# EasyEDA schematic SCH_CAS-808_2025-10-24.json
TITLE: CADS-808; REV: 0.1; Date: 2025-10-24; Sheet: 1/1; Drawn By: stego144Hz; Company: Pandipon Industries
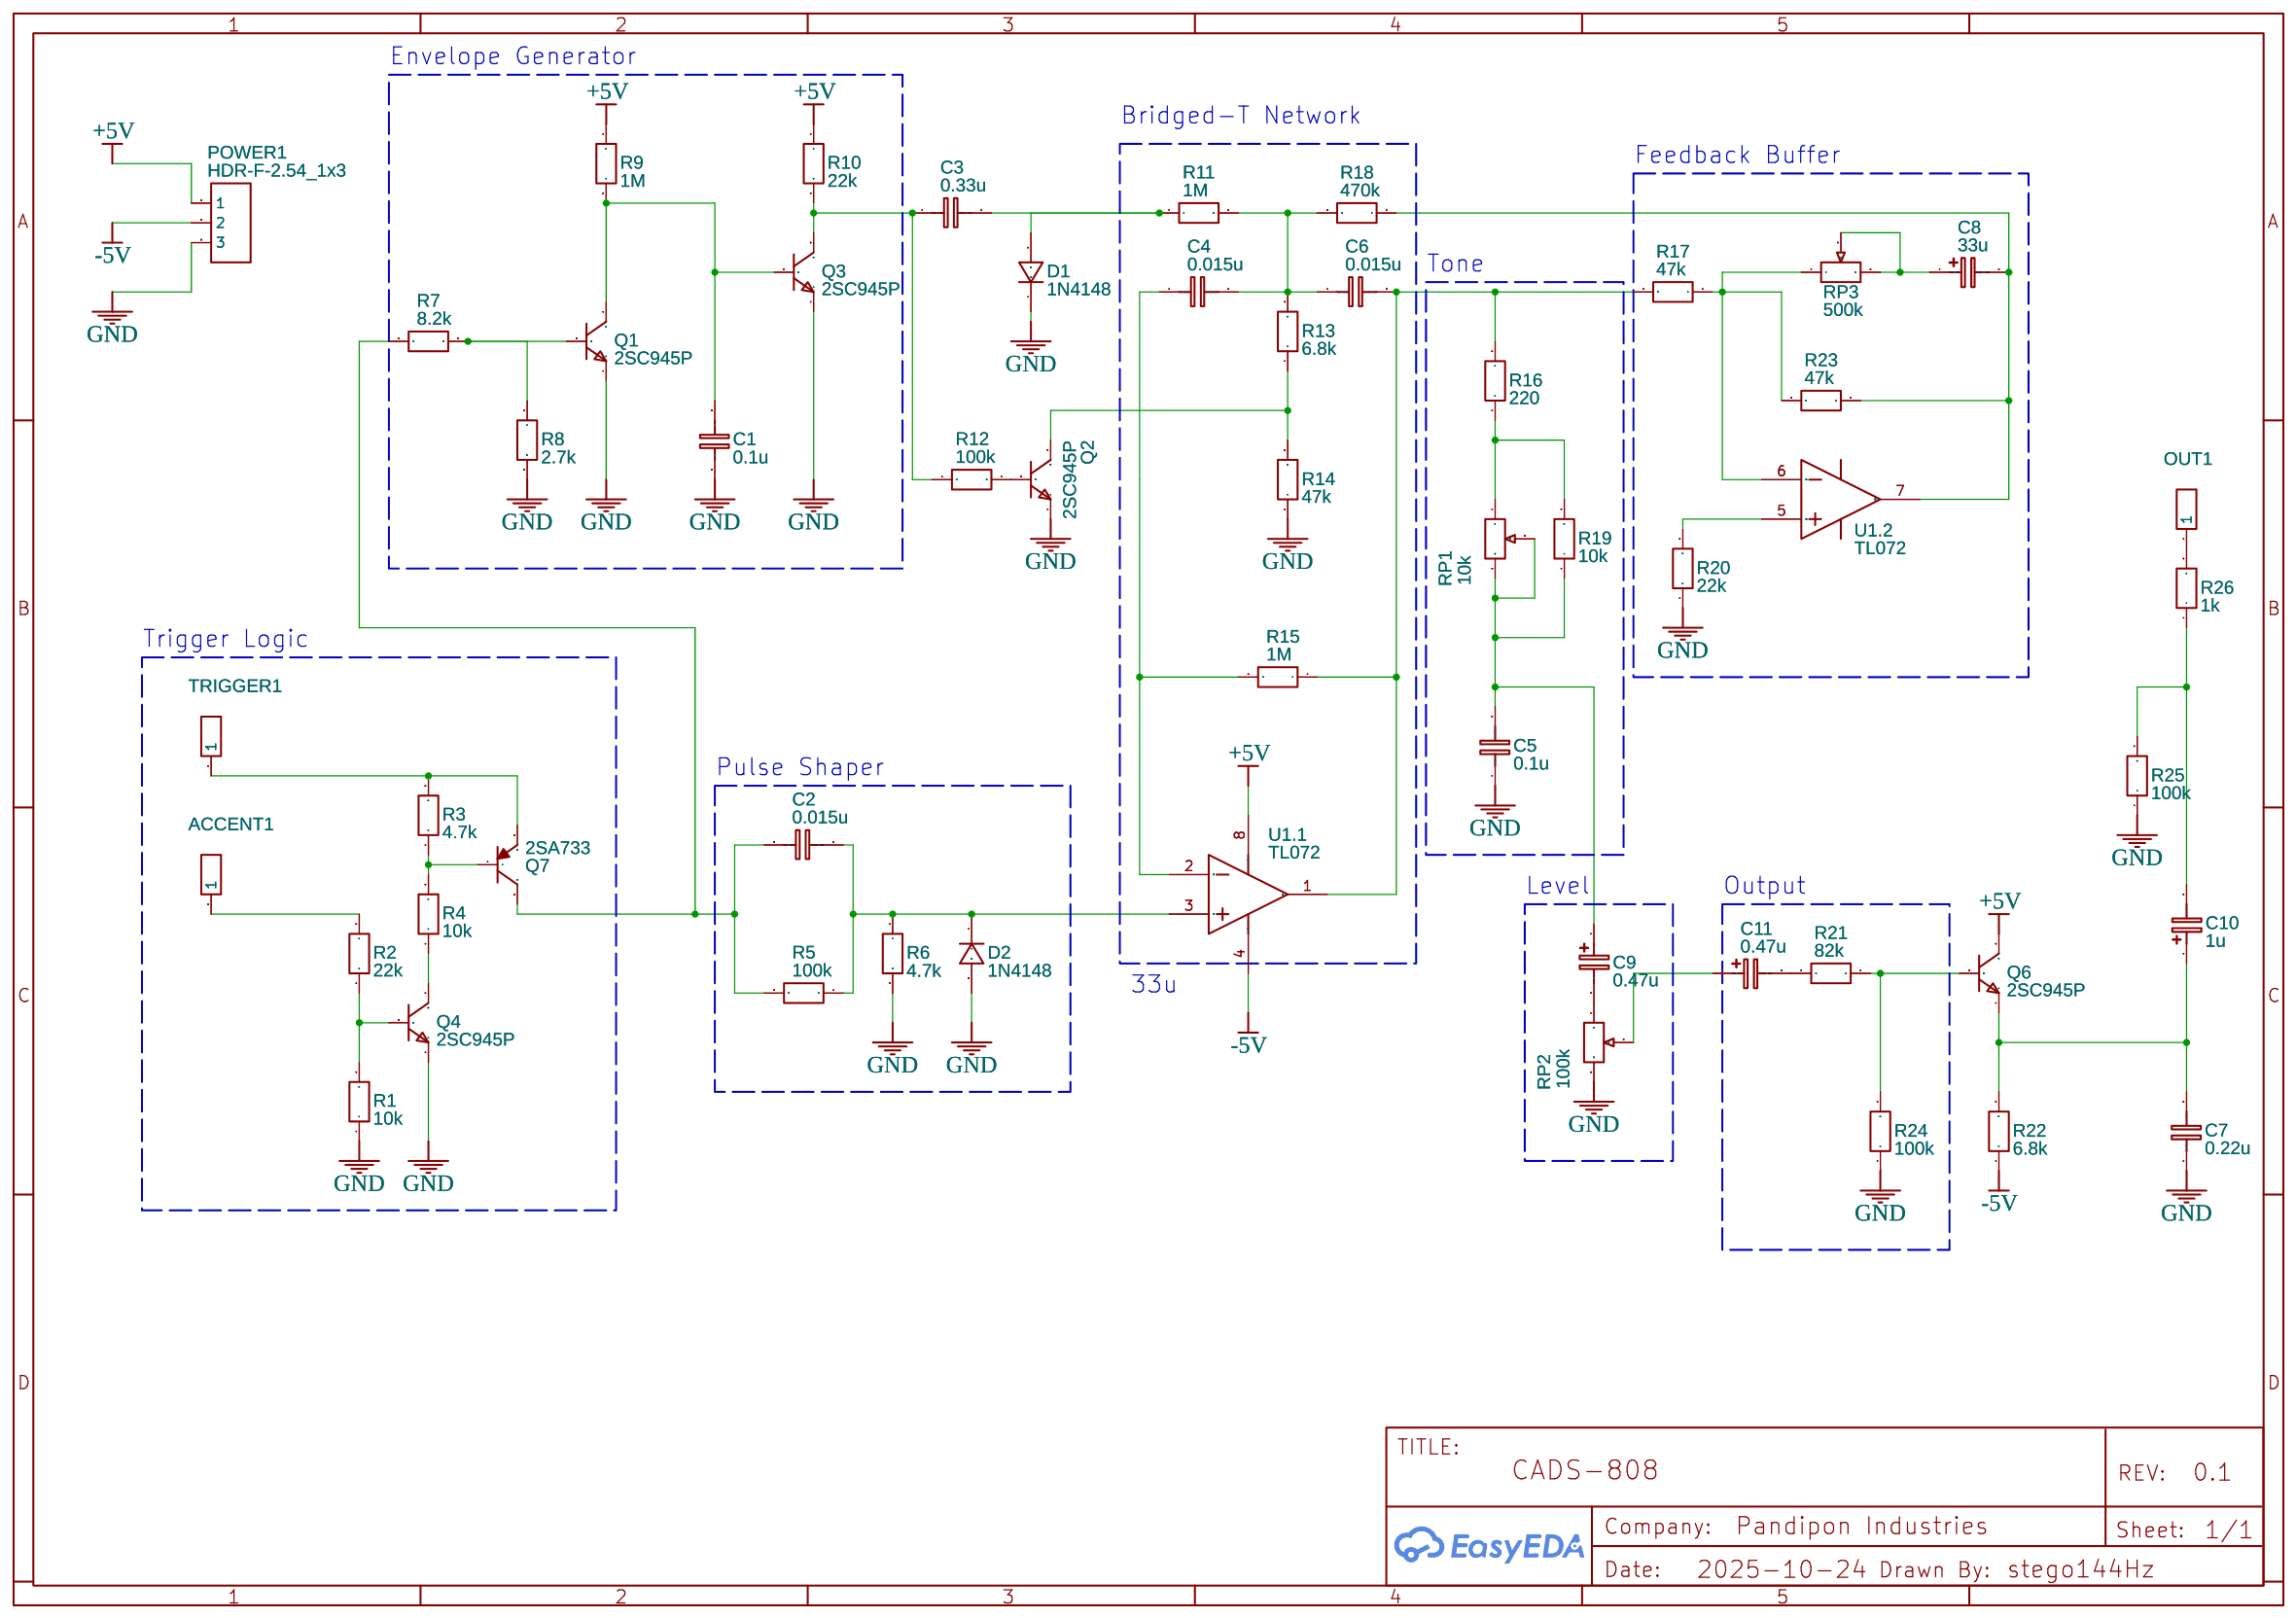
[diagram p0: schematic sheet]

## Parts
ACCENT1  C81276  [HDR-TH_1P-P2.54-V-M]
C1  0.1u  [RAD-0.2]
C2  0.015u  [RAD-0.2]
C3  0.33u  [RAD-0.2]
C4  0.015u  [RAD-0.2]
C5  0.1u  [RAD-0.2]
C6  0.015u  [RAD-0.2]
C7  0.22u  [RAD-0.2]
C8  33u  [CAP-D5.0-F2.0]
C9  0.47u  [CAP-D5.0-F2.0]
C10  1u  [CAP-D5.0-F2.0]
C11  0.47u  [CAP-D5.0-F2.0]
D1  1N4148  [DO-35_BD2.0-L4.2-P8.20-D0.5-RD]
D2  1N4148  [DO-35_BD2.0-L4.2-P8.20-D0.5-RD]
OUT1  C81276  [HDR-TH_1P-P2.54-V-M]
POWER1  HDR-F-2.54_1x3  [HDR-F-2.54_1X3]
Q1  2SC945P  [TO-92-3_L4.9-W3.7-P1.27-L]
Q2  2SC945P  [TO-92-3_L4.9-W3.7-P1.27-L]
Q3  2SC945P  [TO-92-3_L4.9-W3.7-P1.27-L]
Q4  2SC945P  [TO-92-3_L4.9-W3.7-P1.27-L]
Q6  2SC945P  [TO-92-3_L4.9-W3.7-P1.27-L]
Q7  2SA733  [SOT-23-3_L2.9-W1.6-P1.90-LS2.8-BR]
R1  10k  [R_AXIAL-0.4]
R2  22k  [R_AXIAL-0.4]
R3  4.7k  [R_AXIAL-0.4]
R4  10k  [R_AXIAL-0.4]
R5  100k  [R_AXIAL-0.4]
R6  4.7k  [R_AXIAL-0.4]
R7  8.2k  [R_AXIAL-0.4]
R8  2.7k  [R_AXIAL-0.4]
R9  1M  [R_AXIAL-0.4]
R10  22k  [R_AXIAL-0.4]
R11  1M  [R_AXIAL-0.4]
R12  100k  [R_AXIAL-0.4]
R13  6.8k  [R_AXIAL-0.4]
R14  47k  [R_AXIAL-0.4]
R15  1M  [R_AXIAL-0.4]
R16  220  [R_AXIAL-0.4]
R17  47k  [R_AXIAL-0.4]
R18  470k  [R_AXIAL-0.4]
R19  10k  [R_AXIAL-0.4]
R20  22k  [R_AXIAL-0.4]
R21  82k  [R_AXIAL-0.4]
R22  6.8k  [R_AXIAL-0.4]
R23  47k  [R_AXIAL-0.4]
R24  100k  [R_AXIAL-0.4]
R25  100k  [R_AXIAL-0.4]
R26  1k  [R_AXIAL-0.4]
RP1  10k  [SW-TH_0932-POTENTIOMETER]
RP2  100k  [SW-TH_0932-POTENTIOMETER]
RP3  500k  [SW-TH_0932-POTENTIOMETER]
TRIGGER1  C81276  [HDR-TH_1P-P2.54-V-M]
U1  TL072  [TL072]  (sections 1,2)

## Library data of the parts
ACCENT1 OUT1 TRIGGER1 = Header-Male-2.54_1x1: Supplier: LCSC; Manufacturer Part: 2.54-1*1P针; JLCPCB Part Class: Extended Part; Package Display: No; Manufacturer: BOOMELE(Boom Precision Elec); Contributor: Thejo Prakash
C1-C7 = C_0603_EU: Contributor: LCEDA_Lib
C8-C11 = C_Tan_SMD_A_EU: Contributor: LCEDA_Lib
D1 D2 = 1N4148: Supplier: LCSC; Supplier Part: C13769; Manufacturer: STMicroelectronics; Contributor: LCSC
POWER1 = HDR-F-2.54_1x3: Supplier Part: C146690; Supplier: LCSC; Contributor: LCEDA_Lib
Q1-Q4 Q6 = 2SC945P: Contributor: LCSC; Supplier: LCSC; Manufacturer: ST(先科); Supplier Part: C118547; JLCPCB Part Class: Extended Part
Q7 = 2SA733: Contributor: LCSC; Supplier: LCSC; Manufacturer: Hottech(合科泰); Manufacturer Part: A733; Supplier Part: C181155; JLCPCB Part Class: Extended Part
R1-R26 = R_0603_EU: Contributor: LCEDA_Lib
RP1-RP3 = R_3386P_EU: Supplier: LCSC; Contributor: LCEDA_Lib; Value(Ω): 10K
U1 = TL072: subpart_no: 1; Supplier: LCSC; Supplier Part: C529229; Manufacturer: Gcore(扬州国芯); JLCPCB Part Class: Extended Part

## Nets
+5V: POWER1.1 Q6.2(C) R9.1 R10.1 U1.8(VCC+)
-5V: POWER1.2 R22.1 U1.4(VCC-)
GND: C1.1 C5.1 C7.1 D1.1 D2.2 POWER1.3 Q1.1(E) Q2.1(E) Q3.1(E) Q4.1(E) R1.1 R6.2 R8.2 R14.1 R20.1 R24.1 R25.1 RP2.3
Net-(ACCENT1-1): ACCENT1.1 R2.2
Net-(C1-2): C1.2 Q1.2(C) Q3.3(B) R9.2
Net-(C2-1): C2.1 Q7.3 R5.2 R7.1
Net-(C2-2): C2.2 D2.1 R5.1 R6.1 U1.3(1IN+)
Net-(C3-1): C3.1 Q3.2(C) R10.2 R12.1
Net-(C3-2): C3.2 D1.2 R11.1
Net-(C4-1): C4.1 R15.2 U1.2(1IN-)
Net-(C4-2): C4.2 C6.1 R11.2 R13.2 R18.2
Net-(C5-2): C5.2 C9.1 R19.1 RP1.2 RP1.3
Net-(C6-2): C6.2 R15.1 R16.2 R17.2 U1.1(1OUT)
Net-(C7-2): C7.2 C10.1 Q6.1(E) R22.2
Net-(C8-1): C8.1 RP3.2 RP3.3
Net-(C8-2): C8.2 R18.1 R23.1 U1.7(2OUT)
Net-(C9-2): C9.2 RP2.1
Net-(C10-2): C10.2 R25.2 R26.1
Net-(C11-1): C11.1 RP2.2
Net-(C11-2): C11.2 R21.2
Net-(OUT1-1): OUT1.1 R26.2
Net-(Q1-3): Q1.3(B) R7.2 R8.1
Net-(Q2-2): Q2.2(C) R13.1 R14.2
Net-(Q2-3): Q2.3(B) R12.2
Net-(Q4-2): Q4.2(C) R4.1
Net-(Q4-3): Q4.3(B) R1.2 R2.1
Net-(Q6-3): Q6.3(B) R21.1 R24.2
Net-(Q7-1): Q7.1 R3.1 R4.2
Net-(Q7-2): Q7.2 R3.2 TRIGGER1.1
Net-(R16-1): R16.1 R19.2 RP1.1
Net-(R17-1): R17.1 R23.2 RP3.1 U1.6(2IN-)
Net-(R20-2): R20.2 U1.5(2IN+)

## Notes on the sheet
- Envelope Generator
- Bridged-T Network
- Feedback Buffer
- Tone
- Trigger Logic
- Pulse Shaper
- Level
- Output
- 33u
